# Altium project ESP-Project.PrjPcb
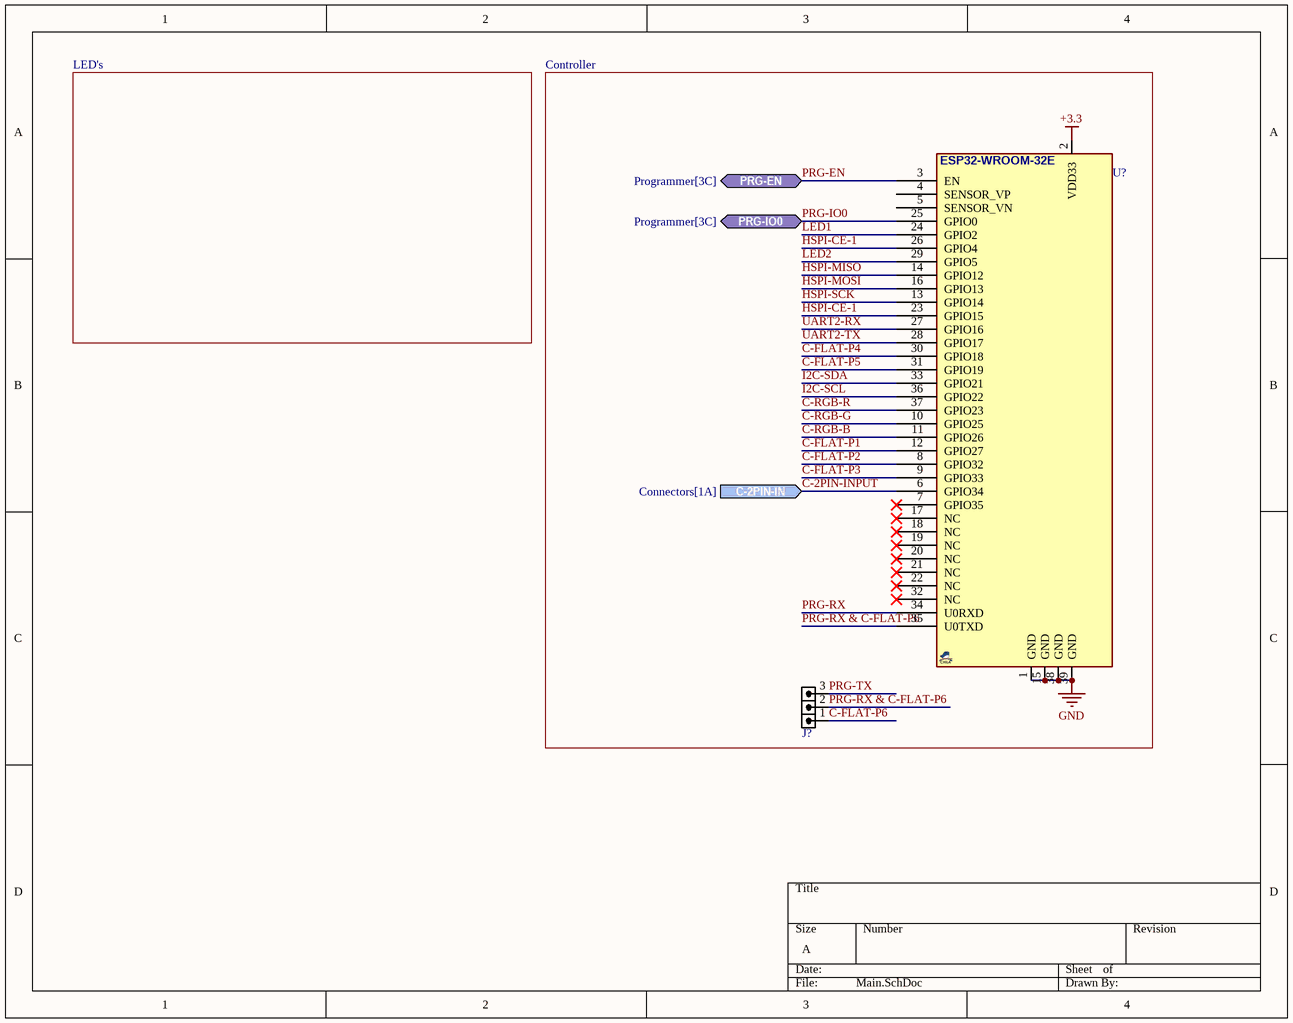
[diagram p0: Main.SchDoc]
5 sheets, 6 parts. Net scope: flat (ports and power ports of the same name join across sheets).
Sheets:
  Main.SchDoc
  ETH-W5500.SchDoc
  Power.SchDoc
  Programmer.SchDoc
  Connectors.SchDoc

## Sheet Main.SchDoc
size A; SheetNumber: 1; SheetTotal: 4

### Parts
(Parts that share a designator on the sheet are numbered #1, #2 ... from top to bottom, then left to right.)
J?  HDRM3  [HDR_M_1X3]  (value not drawn)
U?#1  ESP32-WROOM-32E  [ESP32S]  (value not drawn)

### Blocks framed on the sheet
Controller: J? U?#1

### Ports
C-2PIN-IN (in, see Connectors[1A]), PRG-EN (bidir, see Programmer[3C]), PRG-IO0 (bidir, see Programmer[3C])

### Nets
+3.3: U?#1.2(VDD33)
GND: U?#1.1(GND) U?#1.15(GND) U?#1.38(GND) U?#1.39(GND)
C-2PIN-INPUT: U?#1.6(GPIO34) ; port C-2PIN-IN
C-FLAT-P1: U?#1.12(GPIO27)
C-FLAT-P2: U?#1.8(GPIO32)
C-FLAT-P3: U?#1.9(GPIO33)
C-FLAT-P4: U?#1.30(GPIO18)
C-FLAT-P5: U?#1.31(GPIO19)
C-FLAT-P6: J?.1
C-RGB-B: U?#1.11(GPIO26)
C-RGB-G: U?#1.10(GPIO25)
C-RGB-R: U?#1.37(GPIO23)
HSPI-CE-1: U?#1.23(GPIO15) U?#1.26(GPIO4)
HSPI-MISO: U?#1.14(GPIO12)
HSPI-MOSI: U?#1.16(GPIO13)
HSPI-SCK: U?#1.13(GPIO14)
I2C-SCL: U?#1.36(GPIO22)
I2C-SDA: U?#1.33(GPIO21)
LED1: U?#1.24(GPIO2)
LED2: U?#1.29(GPIO5)
PRG-EN: U?#1.3(EN) ; port PRG-EN
PRG-IO0: U?#1.25(GPIO0) ; port PRG-IO0
PRG-RX: U?#1.34(U0RXD)
PRG-RX & C-FLAT-P6: J?.2 U?#1.35(U0TXD)
PRG-TX: J?.3
UART2-RX: U?#1.27(GPIO16)
UART2-TX: U?#1.28(GPIO17)

Not connected (* = marked no-connect by the designer): U?#1 4(SENSOR_VP) 5(SENSOR_VN) 7(GPIO35)* 17(NC)* 18(NC)* 19(NC)* 20(NC)* 21(NC)* 22(NC)* 32(NC)*

### Notes on the sheet
- LED's

### Library data of the parts
J? = HDR_M_1X3: CONN, HEADER, Male, pitch: 2.54mm, 3POS; VALUE: HDRM3
U?#1 = ESP32-WROOM-32E: WiFi with Bluetooth 4.0; MANF_P#: ESP32-WROOM-32E; VALUE: ESP32-WROOM-32E

## Sheet ETH-W5500.SchDoc
size A; SheetNumber: 2; SheetTotal: 5
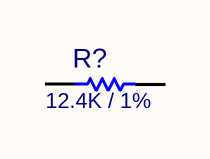
[diagram p1: ETH-W5500.SchDoc]

### Parts
R?  12.4K / 1%  [R0603]

### Nets

Not connected (* = marked no-connect by the designer): R? 1 2

### Library data of the parts
R? = RES_SMD: RESISTOR, SMD; PARAM: -W; DESC: DESCRIPTION; DIST#: MOUSER; MANF_P#: -; MANF: -; ASSEMBLY: ASSEMBLY; PRICE: 100= 0.5$; PARAM2: 1%; VALUE: 12.4K / 1%

## Sheet Power.SchDoc
size A; SheetNumber: 1; SheetTotal: 4

## Sheet Programmer.SchDoc
size A; SheetNumber: 3; SheetTotal: 4
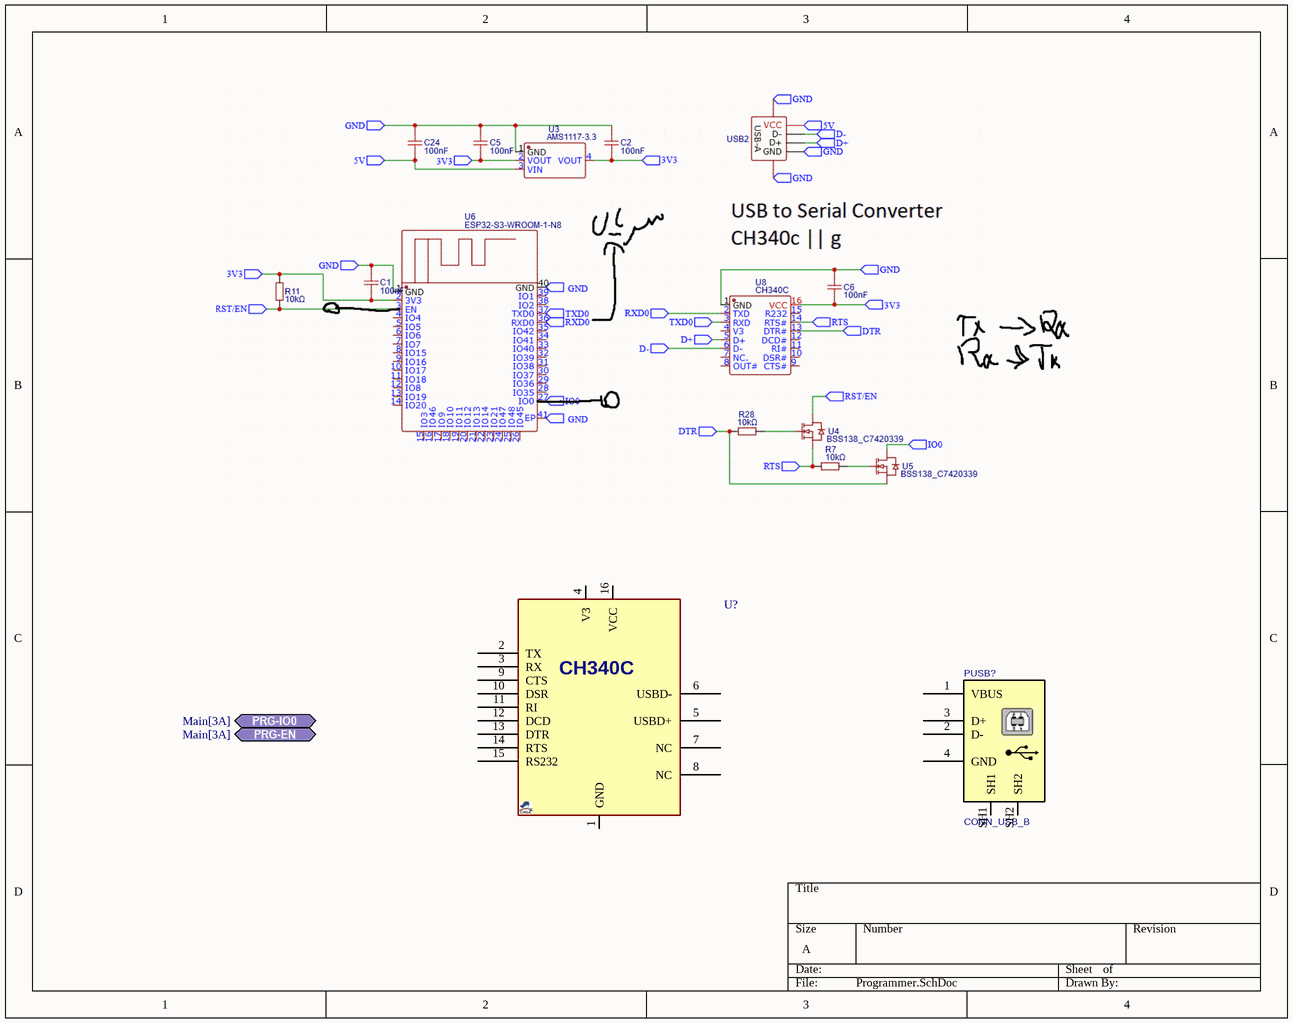
[diagram p2: Programmer.SchDoc]

### Parts
(Parts that share a designator on the sheet are numbered #1, #2 ... from top to bottom, then left to right.)
PUSB?  CONN_USB_B  [USB_B_RA_THD]
U?#2  CH340C  [SO_16]  (value not drawn)

### Ports
PRG-EN (bidir, see Main[3A]), PRG-IO0 (bidir, see Main[3A])

### Nets

Not connected (* = marked no-connect by the designer): PUSB? 1(VBUS) 2(D-) 3(D+) 4(GND) SH1 SH2; U?#2 1(GND) 2(TX) 3(RX) 4(V3) 5(USBD+) 6(USBD-) 7(NC) 8(NC) 9(CTS) 10(DSR) 11(RI) 12(DCD) 13(DTR) 14(RTS) 15(RS232) 16(VCC)

### Library data of the parts
PUSB? = CONN_USB_B_RA_THD: CONN, USB, B, R/A, THD; MANF_P#: 292304-1; MANF: TE Connectivity; VALUE: CONN_USB_B
U?#2 = CH340C_SOP16: USB-UART; MANF_P#: CH340C; VALUE: CH340C; PACKAGE: SOP-16

## Sheet Connectors.SchDoc
size A3; SheetNumber: 4; SheetTotal: 4
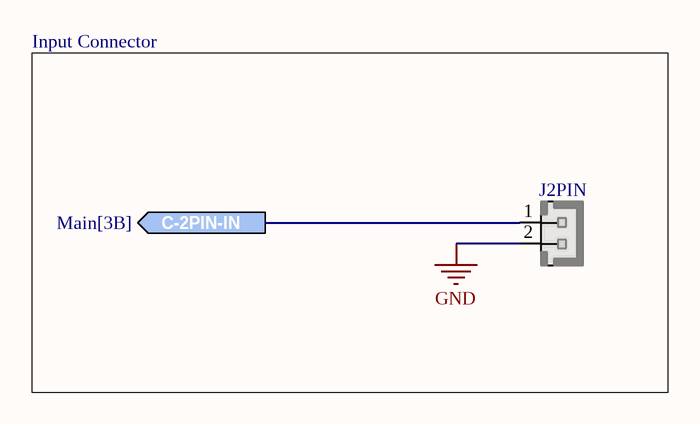
[diagram p3: Connectors.SchDoc]

### Parts
J2PIN  HHDR_2  [XH_2]  (value not drawn)

### Blocks framed on the sheet
Input Connector: J2PIN

### Ports
C-2PIN-IN (out, see Main[3B])

### Nets
GND: J2PIN.2
C-2PIN-INPUT: J2PIN.1 ; port C-2PIN-IN

### Library data of the parts
J2PIN = XH_2: JST-XH pitch: 2.5mm; VALUE: HHDR_2

## Nets that join several sheets
GND: Main (U?#1.1 U?#1.15 U?#1.38 U?#1.39), Connectors (J2PIN.2)
C-2PIN-INPUT: Main (U?#1.6), Connectors (J2PIN.1)